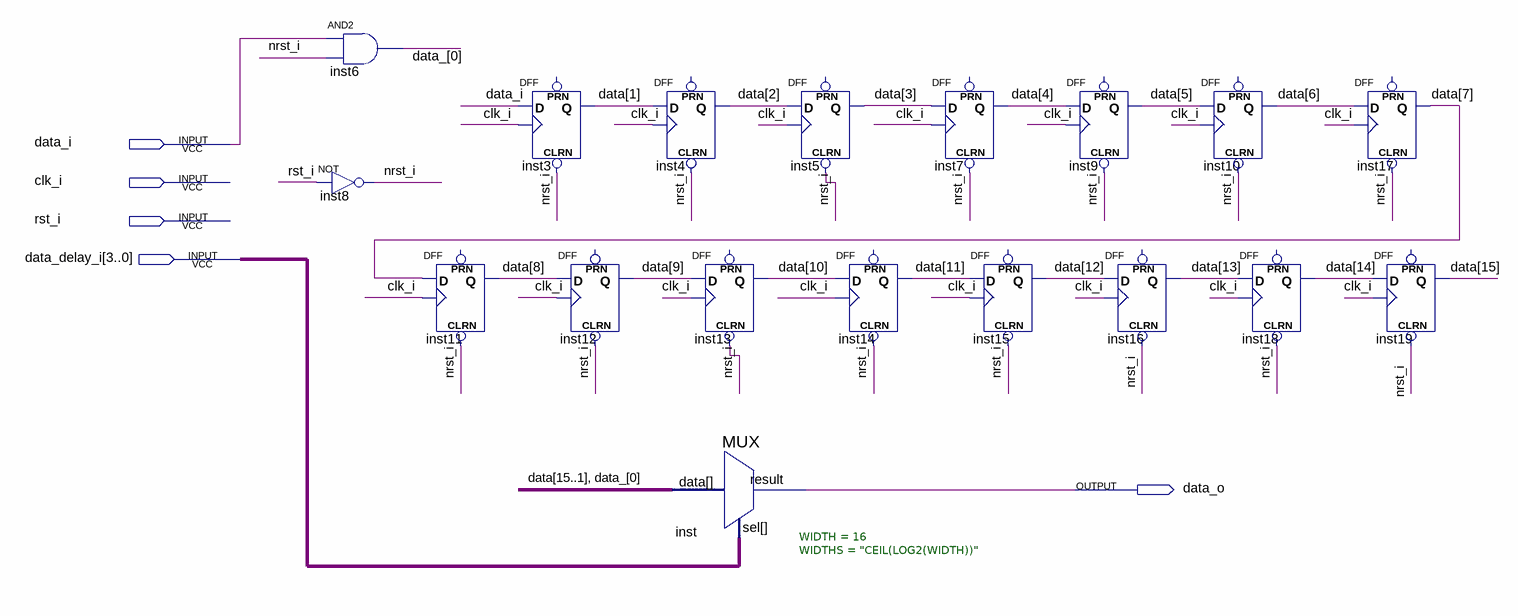
[diagram p0: schematic sheet]
// Quartus schematic delay_15.bdf as structural Verilog: 18 symbols, 5 pins
module delay_15 (
  input  data_i,
  input  clk_i,
  input  rst_i,
  input  [3:0] data_delay_i,
  output data_o
);

  wire nrst_i;
  wire [0:0] data_;
  wire [15:1] data;

  and inst6 (data_[0], data_i, nrst_i);
  not inst8 (nrst_i, rst_i);
  DFF inst11 (.CLRN(nrst_i), .CLK(clk_i), .D(data[7]), .Q(data[8]));  // open: PRN
  DFF inst3 (.CLRN(nrst_i), .CLK(clk_i), .D(data_i), .Q(data[1]));  // open: PRN
  DFF inst12 (.CLRN(nrst_i), .CLK(clk_i), .D(data[8]), .Q(data[9]));  // open: PRN
  DFF inst4 (.CLRN(nrst_i), .CLK(clk_i), .D(data[1]), .Q(data[2]));  // open: PRN
  DFF inst13 (.CLRN(nrst_i), .CLK(clk_i), .D(data[9]), .Q(data[10]));  // open: PRN
  MUX #(.WIDTH(16), .WIDTHS("CEIL(LOG2(WIDTH))")) inst (.data({data, data_[0]}), .sel(data_delay_i), .result(data_o));
  DFF inst5 (.CLRN(nrst_i), .CLK(clk_i), .D(data[2]), .Q(data[3]));  // open: PRN
  DFF inst14 (.CLRN(nrst_i), .CLK(clk_i), .D(data[10]), .Q(data[11]));  // open: PRN
  DFF inst7 (.CLRN(nrst_i), .CLK(clk_i), .D(data[3]), .Q(data[4]));  // open: PRN
  DFF inst15 (.CLRN(nrst_i), .CLK(clk_i), .D(data[11]), .Q(data[12]));  // open: PRN
  DFF inst9 (.CLRN(nrst_i), .CLK(clk_i), .D(data[4]), .Q(data[5]));  // open: PRN
  DFF inst16 (.CLRN(nrst_i), .CLK(clk_i), .D(data[12]), .Q(data[13]));  // open: PRN
  DFF inst10 (.CLRN(nrst_i), .CLK(clk_i), .D(data[5]), .Q(data[6]));  // open: PRN
  DFF inst18 (.CLRN(nrst_i), .CLK(clk_i), .D(data[13]), .Q(data[14]));  // open: PRN
  DFF inst17 (.CLRN(nrst_i), .CLK(clk_i), .D(data[6]), .Q(data[7]));  // open: PRN
  DFF inst19 (.CLRN(nrst_i), .CLK(clk_i), .D(data[14]), .Q(data[15]));  // open: PRN
endmodule
